# EAGLE design harmoshnik (EAGLE 5.04)
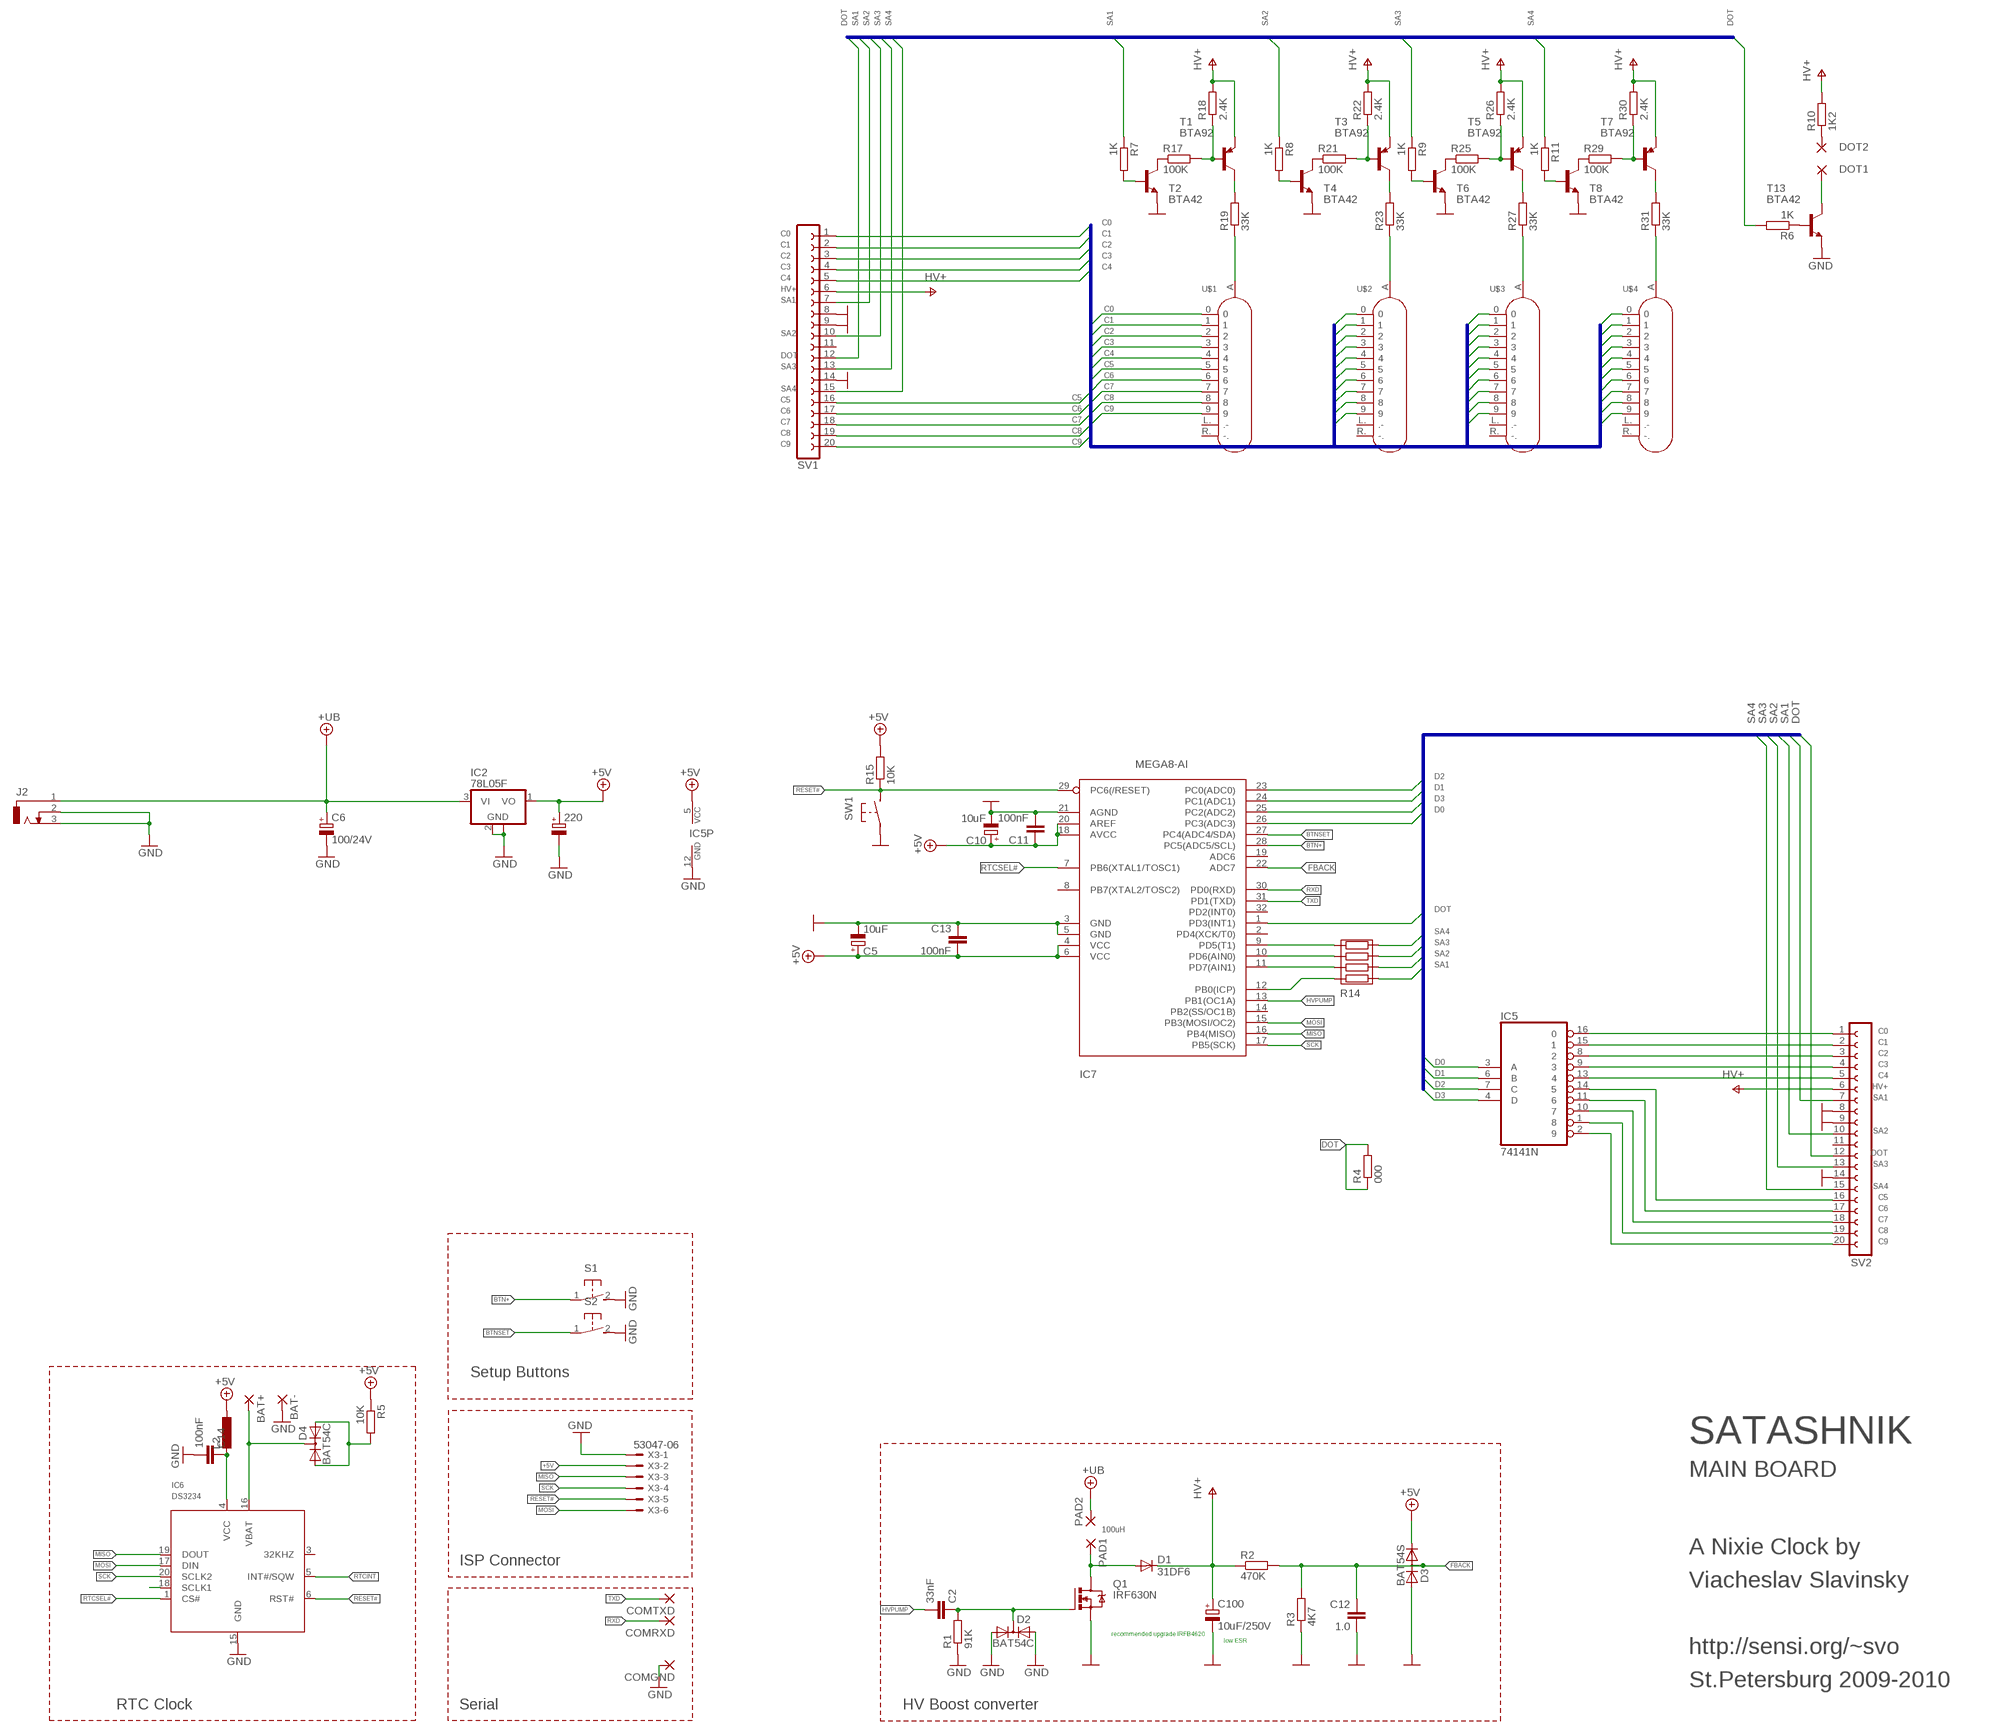
[diagram p0: schematic, sheet 1]

## Parts
220  CPOL-EUD/7343-31R  [D/7343-31R]
BAT+  1,6/0,8  [1,6/0,8]
BAT-  1,6/0,8  [1,6/0,8]
C2  33nF  C-EUC0805S  [C0805S]
C5  10uF  CPOL-EUSMCB  [SMC_B]
C6  100/24V  CPOL-EUE3.5-8  [E3,5-8]
C10  10uF  CPOL-EUSMCB  [SMC_B]
C11  100nF  C-EUC0603K  [C0603K]
C12  1.0  C-EUC0805S  [C0805S]
C13  100nF  C-EUC0603K  [C0603K]
C14  100nF  C-EUC0603K  [C0603K]
C100  10uF/250V  CPOL-EUE5-13  [E5-13]
COMGND  1,6/0,8  [1,6/0,8]
COMRXD  1,6/0,8  [1,6/0,8]
COMTXD  1,6/0,8  [1,6/0,8]
D1  31DF6  RGP30  [DO201-15]
D2  BAT54C  DIODE-2AC|CASOT23  [SOT23]
D3  BAT54S  DIODE_2CACA-SOT23  [SOT23@1]
D4  BAT54C  DIODE-2AC|CASOT23  [SOT23]
DOT1  1,6/0,8  [1,6/0,8]
DOT2  1,6/0,8  [1,6/0,8]
IC2  78L05F  [SOT89]
IC5  74141N  [DIL16]
IC6  DS3234  [SO-20DW]
IC7  MEGA8-AI  [TQFP32-08]
J2  DCJ-SMALL  [DCJ-SMALL]
L2  L-EUL3230M  [L3230M]
PAD1  1,6/0,8  [1,6/0,8]
PAD2  1,6/0,8  [1,6/0,8]
Q1  IRF630N  IRF740  [TO220BV]
R1  91K  R-EU_R0805S  [R0805-SVO]
R2  470K  R-EU_R0805S  [R0805-SVO]
R3  4K7  R-EU_R0805S  [R0805-SVO]
R4  000  R-EU_R0805S  [R0805-SVO]
R5  10K  R-EU_R0805S  [R0805-SVO]
R6  1K  R-EU_R0805S  [R0805-SVO]
R7  1K  R-EU_R0805S  [R0805-SVO]
R8  1K  R-EU_R0805S  [R0805-SVO]
R9  1K  R-EU_R0805S  [R0805-SVO]
R10  1K2  R-EU_R0805S  [R0805-SVO]
R11  1K  R-EU_R0805S  [R0805-SVO]
R14  RES4  [RESSMD-YC16]
R15  10K  R-EU_R0805S  [R0805-SVO]
R17  100K  R-EU_R0805S  [R0805-SVO]
R18  2.4K  R-EU_R0805S  [R0805-SVO]
R19  33K  R-EU_R0805S  [R0805-SVO]
R21  100K  R-EU_R0805S  [R0805-SVO]
R22  2.4K  R-EU_R0805S  [R0805-SVO]
R23  33K  R-EU_R0805S  [R0805-SVO]
R25  100K  R-EU_R0805S  [R0805-SVO]
R26  2.4K  R-EU_R0805S  [R0805-SVO]
R27  33K  R-EU_R0805S  [R0805-SVO]
R29  100K  R-EU_R0805S  [R0805-SVO]
R30  2.4K  R-EU_R0805S  [R0805-SVO]
R31  33K  R-EU_R0805S  [R0805-SVO]
S1  31-XX  [B3F-31XX]
S2  31-XX  [B3F-31XX]
SV1  FE20-1  [FE20]
SV2  FE20-1  [FE20]
SW1  BUTTON-IT_1181  [SW_IT1181]
T1  BTA92  MMBTA92LT1-PNP-SOT23-BEC  [SOT23-BEC]
T2  BTA42  MMBTA42LT1-NPN-SOT23-BEC  [SOT23-BEC]
T3  BTA92  MMBTA92LT1-PNP-SOT23-BEC  [SOT23-BEC]
T4  BTA42  MMBTA42LT1-NPN-SOT23-BEC  [SOT23-BEC]
T5  BTA92  MMBTA92LT1-PNP-SOT23-BEC  [SOT23-BEC]
T6  BTA42  MMBTA42LT1-NPN-SOT23-BEC  [SOT23-BEC]
T7  BTA92  MMBTA92LT1-PNP-SOT23-BEC  [SOT23-BEC]
T8  BTA42  MMBTA42LT1-NPN-SOT23-BEC  [SOT23-BEC]
T13  BTA42  MMBTA42LT1-NPN-SOT23-BEC  [SOT23-BEC]
U$1  IN-14  [IN-14]
U$2  IN-14  [IN-14]
U$3  IN-14  [IN-14]
U$4  IN-14  [IN-14]
X3  53047-06  [53047-06]

## Nets
+5V: 220.+ C5.+ C10.+ C11.1 C13.2 D3.2(C) IC2.1(VO) IC5.5(VCC) IC7.4(VCC) IC7.6(VCC) IC7.18(AVCC) IC7.20(AREF) L2.1 R5.1 R15.2 X3.2
+UB: C6.+ IC2.3(VI) J2.1 PAD2.1(P)
BTN+: IC7.28(PC5(ADC5/SCL)) S1.1(P)
BTNSET: IC7.27(PC4(ADC4/SDA)) S2.1(P)
C0: IC5.16 SV1.1 SV2.1 U$1.0 U$2.0 U$3.0 U$4.0
C1: IC5.15 SV1.2 SV2.2 U$1.1 U$2.1 U$3.1 U$4.1
C2: IC5.8 SV1.3 SV2.3 U$1.2 U$2.2 U$3.2 U$4.2
C3: IC5.9 SV1.4 SV2.4 U$1.3 U$2.3 U$3.3 U$4.3
C4: IC5.13 SV1.5 SV2.5 U$1.4 U$2.4 U$3.4 U$4.4
C5: IC5.14 SV1.16 SV2.16 U$1.5 U$2.5 U$3.5 U$4.5
C6: IC5.11 SV1.17 SV2.17 U$1.6 U$2.6 U$3.6 U$4.6
C7: IC5.10 SV1.18 SV2.18 U$1.7 U$2.7 U$3.7 U$4.7
C8: IC5.1 SV1.19 SV2.19 U$1.8 U$2.8 U$3.8 U$4.8
C9: IC5.2 SV1.20 SV2.20 U$1.9 U$2.9 U$3.9 U$4.9
D0: IC5.3(A) IC7.26(PC3(ADC3))
D1: IC5.6(B) IC7.24(PC1(ADC1))
D2: IC5.7(C) IC7.23(PC0(ADC0))
D3: IC5.4(D) IC7.25(PC2(ADC2))
DOT: IC7.1(PD3(INT1)) R4.1 R4.2 R6.2 SV1.12 SV2.12
FBACK: C12.1 D3.3(AC) IC7.22(ADC7) R2.2 R3.2
GND: 220.- BAT-.1(P) C5.- C6.- C10.- C11.2 C12.2 C13.1 C14.2 C100.- COMGND.1(P) D2.1(A1) D2.2(A2) D3.1(A) IC2.2(GND) IC2.2@1(GND) IC5.12(GND) IC6.15(GND) IC7.3(GND) IC7.5(GND) IC7.21(AGND) J2.2 J2.3 Q1.S R1.1 R3.1 S1.2(S) S2.2(S) SV1.8 SV1.9 SV1.14 SV2.8 SV2.9 SV2.14 SW1.P$1(P1) T2.E T4.E T6.E T8.E T13.E X3.1
HV+: C100.+ D1.C R2.1 R10.2 R18.2 R22.2 R26.2 R30.2 SV1.6 SV2.6 T1.E T3.E T5.E T7.E
HVPUMP: C2.2 IC7.13(PB1(OC1A))
MISO: IC6.19(DOUT) IC7.16(PB4(MISO)) X3.3
MOSI: IC6.17(DIN) IC7.15(PB3(MOSI/OC2)) X3.6
N$1: D4.1(A1) D4.2(A2) R5.2
N$2: IC6.18(SCLK1)
N$3: C2.1 D2.3(C) Q1.G R1.2
N$4: DOT2.1(P) R10.1
N$5: R7.2 T2.B
N$6: R19.2 T1.C
N$7: D1.A PAD1.1(P) Q1.D
N$8: R8.2 T4.B
N$9: BAT+.1(P) D4.3(C) IC6.16(VBAT)
N$10: R19.1 U$1.A
N$11: R21.2 R22.1 T3.B
N$12: R21.1 T4.C
N$13: R23.2 T3.C
N$14: R31.1 U$4.A
N$15: R9.2 T6.B
N$16: R25.2 R26.1 T5.B
N$17: R25.1 T6.C
N$18: R27.2 T5.C
N$19: R23.1 U$2.A
N$20: R11.2 T8.B
N$21: R6.1 T13.B
N$22: R29.2 R30.1 T7.B
N$23: R29.1 T8.C
N$24: R31.2 T7.C
N$25: R27.1 U$3.A
N$26: R17.2 R18.1 T1.B
N$31: IC7.11(PD7(AIN1)) R14.R2$1(2.1)
N$32: IC7.10(PD6(AIN0)) R14.R3$1(3.1)
N$34: IC7.9(PD5(T1)) R14.R4$1(4.1)
N$35: IC7.12(PB0(ICP)) R14.R1$1(1.1)
N$39: R17.1 T2.C
N$51: DOT1.1(P) T13.C
N$53: C14.1 IC6.4(VCC) L2.2
RESET#: IC6.6(RST#) IC7.29(PC6(/RESET)) R15.1 SW1.P$2(P2) X3.5
RTCINT: IC6.5(INT#/SQW)
RTCSEL#: IC6.1(CS#) IC7.7(PB6(XTAL1/TOSC1))
RXD: COMRXD.1(P) IC7.30(PD0(RXD))
SA1: R7.1 R14.R1$2(1.2) SV1.7 SV2.7
SA2: R8.1 R14.R2$2(2.2) SV1.10 SV2.10
SA3: R9.1 R14.R3$2(3.2) SV1.13 SV2.13
SA4: R11.1 R14.R4$2(4.2) SV1.15 SV2.15
SCK: IC6.20(SCLK2) IC7.17(PB5(SCK)) X3.4
TXD: COMTXD.1(P) IC7.31(PD1(TXD))
Unconnected: IC6.3(32KHZ) IC7.2(PD4(XCK/T0)) IC7.8(PB7(XTAL2/TOSC2)) IC7.14(PB2(SS/OC1B)) IC7.19(ADC6) IC7.32(PD2(INT0)) SV1.11 SV2.11 U$1.L.(.-) U$1.R.(-.) U$2.L.(.-) U$2.R.(-.) U$3.L.(.-) U$3.R.(-.) U$4.L.(.-) U$4.R.(-.)

## Buses
D[0..3],SA[1..4],DOT
C[0..9]

## Notes on the sheet
- Setup Buttons
- SATASHNIK
- MAIN BOARD
- 100uH
- A Nixie Clock by
- ISP Connector
- Viacheslav Slavinsky
- recommended upgrade IRFB4620
- low ESR
- http://sensi.org/~svo
- St.Petersburg 2009-2010
- RTC Clock | Serial | HV Boost converter

## Library data of the parts
220 C5 C6 C10 C100 = rcl:CPOL-EU: POLARIZED CAPACITOR, European symbol
BAT+ BAT- COMGND COMRXD COMTXD DOT1 DOT2 PAD1 PAD2 = wirepad:1,6/0,8: THROUGH-HOLE PAD
C2 C11-C14 = rcl:C-EU: CAPACITOR, European symbol
D1 = diode:RGP30: DIODE fast-recovery rectifier
D2 D4 = diode:DIODE-2AC|CA: Dual DIODE Anode-Cathode|Cathode-Anode
D3 = diode:DIODE_2CACA-: 2 Diodes - Cathode-Anode|Cathode-Anode
IC2 = linear:78L*: POSITOIV-VOLTAGE REGULATORS Output up to 100 mA Source: http://focus.ti.com/lit/ds/symlink/ua78l05.pdf
IC5 = 74xx-eu:74*141: BCD to decimal DECODER/DRIVER
IC6 = 0-ds3234:DS3234*: Extremely Accurate SPI Bus RTC with Integrated Crystal and SRAM The DS3234 is a low-cost, extremely accurate SPI? bus real-time clock (RTC) with an integrated temperature-com- pensated crystal oscillator (TCXO) and crystal. The DS3234 incorporates a precision, temperature-compen- sated voltage reference and comparator circuit to monitor VCC. When VCCdrops below the power-fail voltage (VPF), the device asserts the RSToutput and also disables read and write access to the part when VCCdrops below both VPFand VBAT. The RSTpin is monitored as a pushbutton input for generating a µP reset. The device switches to the backup supply input and maintains accurate timekeeping when main power to the device is interrupted. The integra- tion of the crystal resonator enhances the long-term accu- racy of the device as well as reduces the piece-part count in a manufacturing line. The DS3234 is available in com- mercial and industrial temperature ranges, and is offered in an industry-standard 300-mil, 20-pin SO package. The DS3234 also integrates 256 bytes of battery-backed SRAM. In the event of main power loss, the contents of the memory are maintained by the power source con- nected to the VBATpin. The RTC maintains seconds, minutes, hours, day, date, month, and year information. The date at the end of the month is automatically adjust- ed for months with fewer than 31 days, including correc- tions for leap year. The clock operates in either the 24-hour or 12-hour format with AM/PM indicator. Two programmable time-of-day alarms and a programmable square-wave output are provided. Address and data are transferred serially by an SPI bidirectional bus. Accuracy ±2ppm from 0°C to +40°C Accuracy ±3.5ppm from -40°C to +85°C Battery Backup Input for Continuous Timekeeping Operating Temperature Ranges Commercial: 0°C to +70°C Industrial: -40°C to +85°C Low-Power Consumption Real-Time Clock Counts Seconds, Minutes, Hours, Day, Date, Month, and Year with Leap Year Compensation Valid Up to 2099 Two Time-of-Day Alarms Programmable Square-Wave Output 4MHz SPI Bus Supports Modes 1 and 3 Digital Temp Sensor Output: ±3°C Accuracy Register for Aging Trim RSTInput/Output 300-Mil, 20-Pin SO Package Underwriters Laboratories (UL®) Recognized
IC7 = atmel:MEGA8: MICROCONTROLLER 8 Kbytes FLASH, 1 kbytes SRAM, 512 bytes EEPROM, USART, 6-channel 10 bit ADC, 2-channel 8 bit ADC Pin compatible with Atmega48, ATMega88, ATMega168 Source: avr.lbr
J2 = 0-svo:DCJ-SMALL: Smaller DC power jack
L2 = rcl:L-EU: INDUCTOR, European symbol
Q1 = transistor-power:IRF740: N-CHANNEL MOS FET
R1-R11 R15 R17-R19 R21-R23 R25-R27 R29-R31 = rcl:R-EU_: RESISTOR, European symbol
R14 = 0-svo:RES4
S1 S2 = switch-omron:31-XX: OMRON SWITCH
SV1 SV2 = con-lsta:FE20-1: FEMALE HEADER
SW1 = 0-svo:BUTTON-IT_1181
T1 T3 T5 T7 = transistor:*-PNP-: PNP Transistror
T2 T4 T6 T8 T13 = transistor:*-NPN-: NPN Transistror
U$1-U$4 = 0-nixies-russian:IN-14: IN-14 Nixie Tube 170V Strike Voltage 2.5mA Digit Current 0.3mA Dot Current 2 Dots
X3 = con-molex:53?-06: CONNECTOR wire to board 1.25 mm (.049 inch) pitch header

## Board
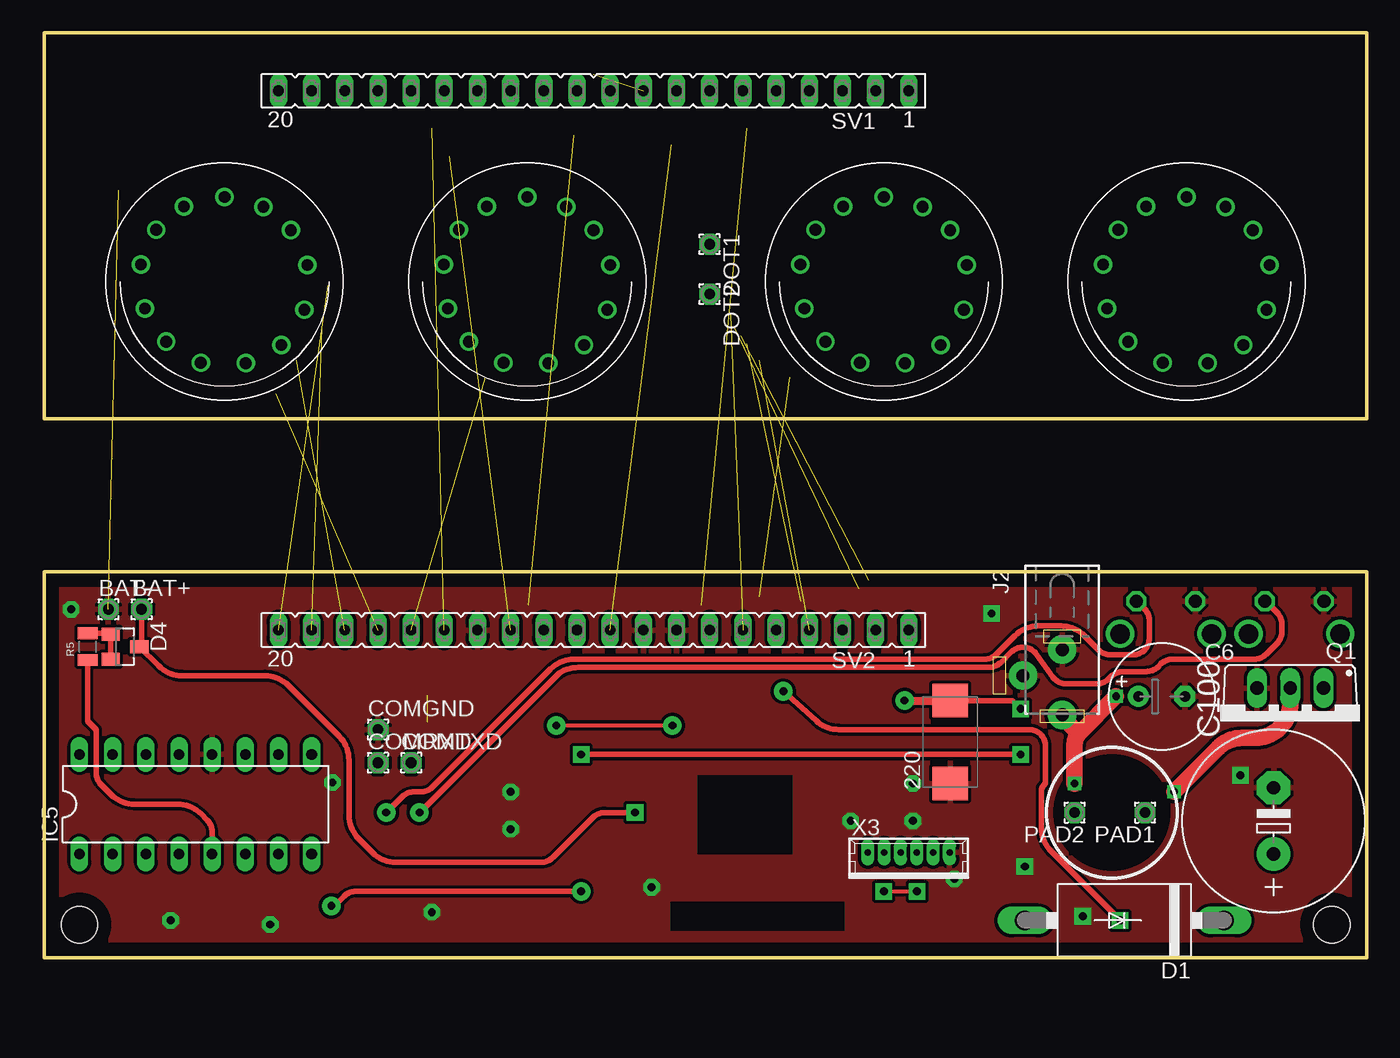
[diagram p1: board, top side]
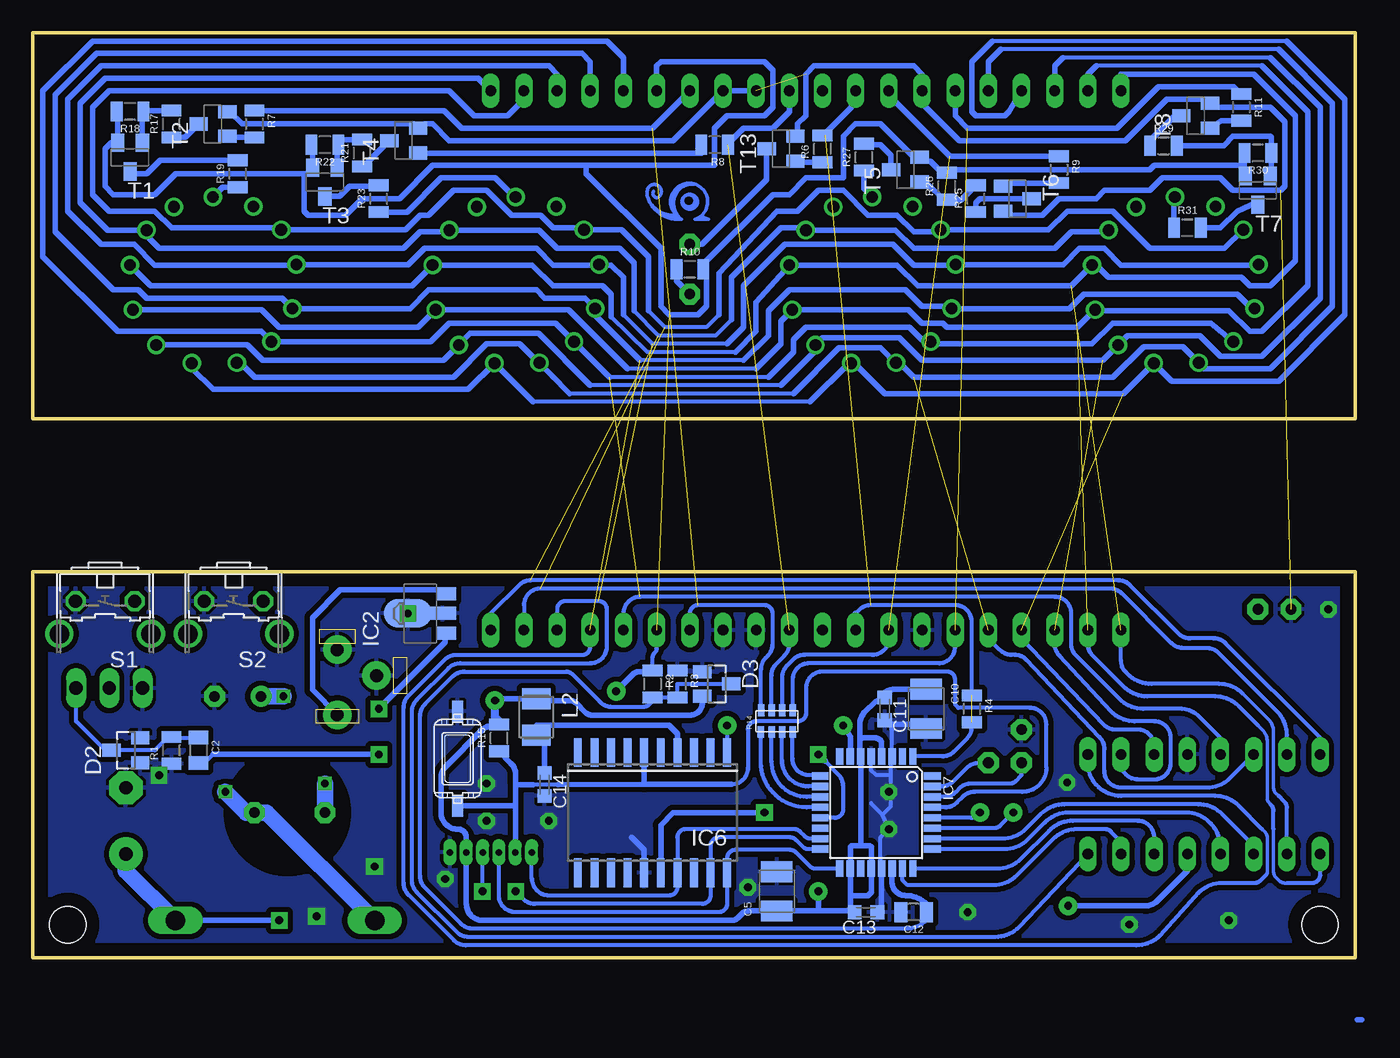
[diagram p2: board, bottom side, seen from below]

Size 101.27 x 70.81 mm. Coordinates in mm from the lower left corner, seen from the top.
Outline: 0,29.54 101.27,29.54 101.27,0 0,0 0,29.54
Outline: 0,70.81 101.27,70.81 101.27,41.27 0,41.27 0,70.81
Copper layers (1*16): Top 0.035mm / dielectric 1.5mm / Bottom 0.035mm
Design rules "default *": minimum track width 10mil, minimum drill 24mil, track to track 10mil, track to pad 10mil, pad to pad 8mil, via to via 8mil, smd to smd 8mil, copper to edge 40mil, drill to drill 8mil, minimum pad ring 10mil, minimum via ring 8mil, stop-mask expansion 4mil, vias tented up to drill 0mil, thermal gap 10mil
Holes 2.8 mm at 98.58,2.54 2.69,2.54
tRestrict: area 50,7.9 to 57.3,14; area 47.9,2.1 to 61.3,4.3; area 77.9,7.3 to 85.6,15
bRestrict: area 77.9,7.3 to 85.6,15

### Footprints (pad centres in the part's own frame; a part is rotated, then mirrored left to right if it is on the bottom)
D/7343-31R = smd 2.55 x 2.7: + 3.175,0; - -3.175,0
1,6/0,8 = drill 0.813 pad 1.6 octagon: 1 0,0
C0805S = smd 1.016 x 1.524: 1 -0.977,0; 2 0.977,0
SMC_B = smd 1.6 x 2.4: + -1.5,0; - 1.5,0
E3,5-8 = drill 0.813 pad 1.6 round: + -1.778,0 | drill 0.813 pad 1.6 octagon: - 1.778,0
C0603K = smd 1.05 x 1.08: 1 -0.875,0; 2 0.875,0
E5-13 = drill 1.016 pad 2.54 round: + -2.54,0 | drill 1.016 pad 2.54 octagon: - 2.54,0
DO201-15 = drill 1.499 long: A 7.62,0; C -7.62,0
SOT23 = smd 1 x 1.4: 1 -0.95,-1.1; 2 0.95,-1.1; 3 0,1.1
SOT23@1 = smd 1 x 1.4: 1 -0.95,-1.1; 2 0.95,-1.1; 3 0,1.1
SOT89 = smd 1 x 1.5: 1 -1.499,-1.981; 3 1.499,-1.981 | smd 1 x 2: 2 0,-1.727 | smd 2.2 x 3.7: 2@1 0,0.94
DIL16 = drill 0.813 long: 1 -8.89,-3.81; 2 -6.35,-3.81; 3 -3.81,-3.81; 4 -1.27,-3.81; 5 1.27,-3.81; 6 3.81,-3.81; 7 6.35,-3.81; 8 8.89,-3.81; 9 8.89,3.81; 10 6.35,3.81; 11 3.81,3.81; 12 1.27,3.81; 13 -1.27,3.81; 14 -3.81,3.81; 15 -6.35,3.81; 16 -8.89,3.81
SO-20DW = smd 0.6 x 2.2: 1 -5.715,-4.6; 2 -4.445,-4.6; 3 -3.175,-4.6; 4 -1.905,-4.6; 5 -0.635,-4.6; 6 0.635,-4.6; 7 1.905,-4.6; 8 3.175,-4.6; 9 4.445,-4.6; 10 5.715,-4.6; 11 5.715,4.6; 12 4.445,4.6; 13 3.175,4.6; 14 1.905,4.6; 15 0.635,4.6; 16 -0.635,4.6; 17 -1.905,4.6; 18 -3.175,4.6; 19 -4.445,4.6; 20 -5.715,4.6
TQFP32-08 = smd 1.27 x 0.559: 1 -4.293,2.8; 2 -4.293,2; 3 -4.293,1.2; 4 -4.293,0.4; 5 -4.293,-0.4; 6 -4.293,-1.2; 7 -4.293,-2; 8 -4.293,-2.8; 17 4.293,-2.8; 18 4.293,-2; 19 4.293,-1.2; 20 4.293,-0.4; 21 4.293,0.4; 22 4.293,1.2; 23 4.293,2; 24 4.293,2.8 | smd 0.559 x 1.27: 9 -2.8,-4.293; 10 -2,-4.293; 11 -1.2,-4.293; 12 -0.4,-4.293; 13 0.4,-4.293; 14 1.2,-4.293; 15 2,-4.293; 16 2.8,-4.293; 25 2.8,4.293; 26 2,4.293; 27 1.2,4.293; 28 0.4,4.293; 29 -0.4,4.293; 30 -1.2,4.293; 31 -2,4.293; 32 -2.8,4.293
DCJ-SMALL = drill 1 pad 2.184 round: 1 0,3; 2 3,0; 3 0,-2
L3230M = smd 1.6 x 2.2: 1 -1.4,0; 2 1.4,0
TO220BV = drill 1.016 long: D 0,-2.54; G -2.54,-2.54; S 2.54,-2.54
R0805-SVO = smd 0.9 x 1.524: 1 -1.027,0; 2 1.027,0
RESSMD-YC16 = smd 0.508 x 0.914: R1$1 -1.23,-0.821; R1$2 -1.2,0.851; R2$1 -0.4,-0.821; R2$2 -0.4,0.851; R3$1 0.4,-0.821; R3$2 0.4,0.851; R4$1 1.2,-0.821; R4$2 1.2,0.851
B3F-31XX = drill 1.016 octagon: 1 -2.261,-1.245; 2 2.261,-1.245 | drill 1.499 pad 2.159 round: 3 -3.505,1.245; 4 3.505,1.245
FE20 = drill 0.813 long: 1 -24.13,0; 2 -21.59,0; 3 -19.05,0; 4 -16.51,0; 5 -13.97,0; 6 -11.43,0; 7 -8.89,0; 8 -6.35,0; 9 -3.81,0; 10 -1.27,0; 11 1.27,0; 12 3.81,0; 13 6.35,0; 14 8.89,0; 15 11.43,0; 16 13.97,0; 17 16.51,0; 18 19.05,0; 19 21.59,0; 20 24.13,0
SW_IT1181 = smd 1.676 x 0.813: P$1 -3.61,0; P$2 3.61,0
SOT23-BEC = smd 1 x 1.4: B -0.95,-1.1; C 0,1.1; E 0.95,-1.1
IN-14 = drill 0.9 round: 0 -5.08,-3.937; 1 5.232,-3.973; 2 6.393,-1.307; 3 6.089,2.063; 4 4.469,4.594; 5 1.822,6.213; 6 -1.621,6.243; 7 -4.348,4.846; 8 -6.12,2.154; 9 -6.35,-1.27; A 0,-6.477; L. 3.104,-5.752; R. -2.978,-5.725
53047-06 = drill 0.5 pad 0.698 long: 1 3.125,0.45; 2 1.875,0.45; 3 0.625,0.45; 4 -0.625,0.45; 5 -1.875,0.45; 6 -3.125,0.45

### Placement (x,y rotation side)
220  69.37,16.52 90 top
BAT+  7.46,26.68 0 top
BAT-  4.92,26.68 0 top
C2  88.58,15.88 270 bottom
C5  44.28,5.08 90 bottom
C6  85.56,20.01 0 top
C10  32.85,19.05 270 bottom
C11  36.03,19.05 270 bottom
C12  33.81,3.5 180 bottom
C13  37.46,3.5 180 bottom
C14  62.06,13.26 270 bottom
C100  94.13,10.48 90 top
COMGND  25.55,17.47 0 top
COMRXD  25.55,14.93 0 top
COMTXD  28.09,14.93 0 top
D1  82.7,2.86 180 top
D2  94.13,15.88 90 bottom
D3  48.89,20.96 270 bottom
D4  6.19,23.82 270 top
DOT1  50.95,54.62 270 top
DOT2  50.95,50.8 270 top
IC2  71.59,26.36 90 bottom
IC5  11.58,11.75 0 top
IC6  53.81,11.12 180 bottom
IC7  36.66,11.12 270 bottom
J2  77.94,21.6 180 top
L2  62.7,18.42 270 bottom
PAD1  84.29,11.12 180 top
PAD2  78.89,11.12 180 top
Q1  95.4,18.1 180 top
R1  90.64,15.88 90 bottom
R2  53.81,20.96 270 bottom
R3  51.91,20.96 270 bottom
R4  29.36,19.05 270 bottom
R5  3.33,23.82 90 top
R6  40.79,61.92 90 bottom
R7  84.29,63.82 270 bottom
R8  49.05,62.24 180 bottom
R9  22.69,60.33 270 bottom
R10  50.95,52.71 0 bottom
R11  8.72,65.09 270 bottom
R14  44.28,18.1 0 bottom
R15  65.56,16.83 90 bottom
R17  90.64,63.82 90 bottom
R18  93.81,64.77 180 bottom
R19  85.56,60.01 90 bottom
R21  76.03,61.6 90 bottom
R22  78.89,62.24 180 bottom
R23  74.77,58.11 90 bottom
R25  29.04,58.11 90 bottom
R26  31.27,59.06 90 bottom
R27  37.62,61.28 90 bottom
R29  14.68,62.16 0 bottom
R30  7.46,61.6 180 bottom
R31  12.85,55.88 0 bottom
S1  95.72,26.04 180 bottom
S2  85.88,26.04 180 bottom
SV1  42.06,66.36 180 top
SV2  42.06,25.09 180 top
SW1  68.73,15.25 270 bottom
T1  93.81,61.28 180 bottom
T2  87.47,63.82 90 bottom
T3  78.89,59.38 180 bottom
T4  72.86,62.55 90 bottom
T5  34.44,60.33 90 bottom
T6  25.87,58.11 270 bottom
T7  7.46,58.74 180 bottom
T8  12.22,64.46 90 bottom
T13  43.97,61.92 90 bottom
U$1  87.47,51.76 180 top
U$2  64.29,51.76 180 top
U$3  36.98,51.76 180 top
U$4  13.8,51.76 180 top
X3  66.19,7.62 0 top

### Tracks (layer width: path | path; a pad name or v marks a point on that pad's centre or on a via)
+5V  (via drill 0.6 pad 1.27, 0.6 pad 1.42)
  Top 0.406: 69.37,20.64 220.+ 74.13,19.69 v74.77,19.05 | v41.11,5.09 23.86,5.09 arc45 22.96,4.71 22.06,3.82 v21.98,3.97 | R5.1 3.33,18.1 3.96,17.47 3.96,14.18 arc45 4.33,13.29 5.12,12.5 arc45 6.92,11.75 10.21,11.75 arc-45 12.01,11.01 12.48,10.54 arc-45 12.85,9.64 IC5.5
  Top 0.61: v65.88,19.69 220.+
  Bottom 0.305: 37.06,8.5 37.14,8.58 | IC7.20 | 37.93,8.58 37.86,8.66 | IC7.6 37.86,16.74
  Bottom 0.406: 37.14,8.58 37.93,8.58 38.57,8.58 | 37.06,8.5 IC7.20 37.06,5.01 37.3,4.77 38.67,4.77 | 37.86,8.66 37.86,15.4 IC7.6 37.93,15.48 37.93,17.89 arc45 37.56,18.79 36.74,19.61 C11.1 36.35,20.01 36.17,20.18 arc45 35.27,20.55 C10.+ | 38.67,8.48 38.67,6.93 38.65,6.91 38.65,6.83 | 38.65,6.83 38.65,6.67 | 38.73,6.91 38.65,6.83 | 38.73,6.91 38.73,7.31 | 38.73,6.91 38.73,6.59 38.67,6.66 IC7.18 38.67,4.77 | 38.89,3.59 38.57,3.59 | 38.57,3.59 38.42,3.59 | 41.11,3.59 38.89,3.59 | 38.67,4.77 38.67,3.81 38.89,3.59 | v41.11,5.09 41.11,3.59 | 65.56,18.1 R15.2 65.63,17.78 65.98,17.78 arc-45 66.88,17.41 69.63,14.66 arc-45 70,13.77 70,11.12 arc-90 68.73,9.85 arc90 68.07,9.18 X3.2 68.07,4.13 arc-90 66.8,2.86 47.72,2.86 arc-45 47.27,3.05 46.92,3.4 arc45 46.47,3.59 C5.+ 41.11,3.59 | IC7.4 36.27,16.43 arc-78 36.76,16.83 37.78,16.83 37.86,16.74 | D3.2 49.99,19.53 arc90 50.94,18.58 58.47,18.58 arc45 58.92,18.76 59.66,19.5 arc-45 60.11,19.69 62.57,19.69 L2.1 65.75,19.82 v65.88,19.69 | IC5.5 12.85,6.67 15.18,4.35 arc45 16.08,3.97 v21.98,3.97 | IC2.1 69.69,24.78 69.69,24.14 v74.77,19.05 | C13.2 38.48,3.5 38.57,3.59
  Bottom 0.61: v65.88,19.69 65.88,18.42 65.56,18.1
+UB  (via drill 0.6)
  Top 1.27: 79.21,17.15 v82.07,20.01 | J2.1 77.94,18.42 79.21,17.15 | v78.89,13.34 78.89,16.38 arc-45 79.21,17.15
  Bottom 0.406: J2.1 79.85,20.5 79.85,26.04 77.71,28.17 70.38,28.17 arc45 IC2.3
  Bottom 1.27: PAD2.1 v78.89,13.34 | v82.07,20.01 C6.+
BTN+  (via drill 0.6 pad 1.42)
  Top 0.406: S1.1 93.52,27.28 94.4,26.41 arc-45 94.77,25.51 94.77,24.98 arc-45 94.4,24.08 93.55,23.24 arc-45 92.65,22.87 86.4,22.87 arc45 85.51,22.49 85.3,22.28 arc-45 84.4,21.91 82.59,21.91 arc45 81.7,21.54 81.49,21.33 arc-45 80.59,20.96 78.27,20.96 arc-54 77.24,21.48 75.96,23.25 arc99 74.03,23.4 73.23,22.6 arc-45 72.33,22.23 40.89,22.23 arc45 39.1,21.49 v28.73,11.12
  Bottom 0.305: IC7.28 29.39,10.72 arc-45 28.94,10.9 v28.73,11.12
BTNSET  (via drill 0.6 pad 1.42)
  Top 0.406: S2.1 83.68,27.28 84.24,26.73 arc-45 84.61,25.83 84.61,24.45 arc-90 83.34,23.18 81.64,23.18 arc-45 80.74,23.55 79.64,24.66 arc45 77.84,25.41 76.13,25.41 arc45 74.34,24.66 72.91,23.24 arc-45 72.02,22.87 57.62,22.87 40.57,22.87 arc45 38.78,22.12 29.73,13.08 arc-45 28.84,12.7 28.3,12.7 arc45 27.4,12.33 v26.19,11.12
  Bottom 0.305: IC7.27 27.65,9.92 arc-45 27.2,10.1 v26.19,11.12
C0  (1 unrouted)
  Bottom 0.305: SV2.1 66.19,26.36 64.02,28.53 arc45 63.13,28.9 18.14,28.9 arc45 17.24,28.53 13.54,24.82 arc-45 12.64,24.45 10.84,24.45 arc45 9.94,24.08 2.69,16.83 IC5.16 | 47.78,48.82 48.97,47.63 53.33,47.63 55.24,49.54
  Bottom 0.406: U$4.0 19.01,55.57 21.74,55.57 23.01,54.3 33.81,54.3 35.2,55.69 U$3.0 42.25,55.88 43.97,55.88 47.78,52.08 47.78,48.82 | SV1.1 67.14,67.32 95.72,67.32 97.63,65.41 97.63,57.79 95.53,55.69 U$1.0 92.55,55.25 91.59,54.3 72.86,54.3 71.59,55.57 69.49,55.57 U$2.0 62.51,55.69 61.11,54.3 56.35,54.3 55.24,53.19 55.24,49.54
C1  (1 unrouted)
  Bottom 0.305: IC5.15 5.23,17.05 arc-45 5.98,18.85 10.47,23.34 arc-45 11.36,23.71 13.17,23.71 arc45 14.07,24.08 17.88,27.89 arc-45 18.78,28.26 62.38,28.26 arc-90 63.65,26.99 SV2.2 | 48.73,49.22 49.68,48.26 52.86,48.26 54.13,49.54
  Bottom 0.406: U$2.1 59.22,55.57 | 8.74,55.57 U$4.1 10.01,54.3 15.71,54.3 18.57,57.16 22.06,57.16 23.48,55.73 U$3.1 31.91,55.57 33.81,55.57 35.08,56.84 37.3,56.84 39.21,58.74 41.11,58.74 42.7,57.16 44.28,57.16 48.73,52.39 48.73,49.22 | U$2.1 | U$2.1 59.21,55.88 61.43,55.88 62.38,56.84 64.61,56.84 66.51,58.74 69.05,58.74 70.96,56.84 71.59,56.84 72.7,55.73 U$1.1 82.39,55.88 90.64,55.88 91.91,57.16 95.4,57.16 96.67,58.43 96.67,65.09 95.4,66.36 69.37,66.36 67.46,64.46 64.92,64.46 63.65,65.73 SV1.2 | U$2.1 56.2,55.73 54.13,53.66 54.13,49.54
C2  (1 unrouted)
  Bottom 0.305: SV2.3 61.11,26.67 arc90 60.48,27.31 57.94,27.31 arc90 57.3,26.67 57.3,23.82 arc90 58.57,22.55 68.52,22.55 arc-45 69.42,22.18 71.85,19.74 arc-45 72.22,18.85 72.22,5.93 arc-45 71.85,5.03 68.79,1.96 arc-45 67.89,1.59 27.56,1.59 arc-45 25.76,2.34 IC5.8 | 48.1,46.99 53.81,46.99 56.03,49.22
  Bottom 0.406: U$4.2 7.45,53.03 17.93,53.03 19.2,54.3 21.11,54.3 22.34,53.06 U$3.2 30.63,53.03 33.81,53.03 35.39,54.62 43.65,54.62 46.82,51.44 46.82,48.26 48.1,46.99 | SV1.3 61.11,67.63 61.75,68.27 96.04,68.27 98.58,65.73 98.58,57.16 96.04,54.62 93.5,54.62 91.91,53.03 81.11,53.03 U$1.2 72.51,53.06 71.27,54.3 62.7,54.3 61.43,53.03 57.93,53.03 U$2.2 57.86,53.03 56.99,53.03 56.03,52.08 56.03,49.22
C3  (1 unrouted)
  Bottom 0.254: 6.82,6.35 arc-45 6.74,6.55 6.74,9.19 arc-45 6.93,9.64 7.14,9.85
  Bottom 0.305: 6.82,6.35 7.27,5.91 arc45 7.72,5.72 10.21,5.72 arc-45 12.01,4.98 14.97,1.7 arc45 16.76,0.96 68.11,0.96 arc45 69,1.33 72.49,4.81 arc45 72.86,5.71 72.86,19.16 arc45 72.49,20.06 69.74,22.81 arc45 68.84,23.18 59.21,23.18 arc-90 58.57,23.82 SV2.4 | 7.14,9.85 8.93,11.64 arc-45 10.73,12.39 17.93,12.39 arc90 20.47,14.93 IC5.9 | 46.82,45.73 54.76,45.73
  Bottom 0.406: U$4.3 7.88,49.54 7.77,49.54 9.04,50.8 20.79,50.8 21.9,49.69 U$3.3 31.05,49.85 33.17,49.85 34.44,51.12 43.33,51.12 44.92,49.54 44.92,47.63 46.82,45.73 | SV1.4 58.57,68.59 59.21,69.22 96.36,69.22 99.53,66.04 99.53,55.57 95.08,51.12 93.18,51.12 92.55,50.49 82.17,50.49 U$1.3 72.38,49.69 70.96,51.12 62.7,51.12 62.06,50.49 58.99,50.49 U$2.3 58.25,49.64 58.25,49.22 54.76,45.73
C4  (1 unrouted)
  Bottom 0.305: SV2.5 56.03,26.36 arc90 54.76,27.63 23.01,27.63 arc90 21.74,26.36 21.74,24.03 arc-45 21.37,23.13 18.04,19.8 arc-45 16.25,19.05 13.27,19.05 arc45 11.79,18.31 10.31,16.83 IC5.13 | 44.92,44.45 57.11,44.45
  Bottom 0.406: 32.54,46.99 32.68,46.99 U$3.4 | U$3.4 32.39,47.16 32.22,46.99 20.15,46.99 18.57,48.58 11.07,48.58 U$4.4 | U$3.4 32.66,47.31 33.17,47.31 34.13,48.26 42.06,48.26 43.02,47.31 43.02,46.36 44.92,44.45 | SV1.5 56.03,68.9 57.3,70.17 96.67,70.17 100.48,66.36 100.48,53.66 94.77,47.95 83.78,47.95 U$1.4 70.79,47.16 69.37,48.58 61.24,48.58 U$2.4 57.11,44.45
C5  (1 unrouted)
  Bottom 0.305: SV2.16 28.09,24.45 27.19,23.55 arc-45 26.3,23.18 26.08,23.18 arc45 25.18,22.81 19.57,16.89 arc45 19.2,15.99 19.2,14.29 arc-90 17.93,13.02 11.36,13.02 arc-45 9.57,13.77 IC5.14 | 5.87,69.54 27.14,69.54 | 43.02,43.19 60.16,43.19
  Bottom 0.406: U$1.5 85.38,45.54 84.29,44.45 69.05,44.45 66.51,46.99 63.97,46.99 62.38,45.41 | 62.38,45.41 62.6,45.41 U$2.5 62.47,45.49 62.38,45.41 | 61.59,44.61 61.43,44.45 | 61.59,44.61 62.38,45.41 | SV1.16 28.09,68.59 27.14,69.54 | 5.87,69.54 1.74,65.41 1.74,49.85 6.5,45.09 11.58,45.09 11.85,45.41 U$4.5 13.2,46.76 16.19,46.76 18.57,44.45 33.81,44.45 34.9,45.54 U$3.5 35.3,45.41 35.08,45.41 36.35,46.68 39.52,46.68 43.02,43.19 | 60.16,43.19 61.59,44.61
C6  (1 unrouted)
  Bottom 0.305: IC5.11 15.39,16.2 arc-90 16.66,17.47 18.36,17.47 arc45 19.26,17.84 25.55,24.45 SV2.17 | 5.23,70.17 27.78,70.17 | 41.74,42.55 62.94,42.55
  Bottom 0.406: U$1.6 89.09,45.12 87.47,43.5 67.92,43.5 U$2.6 62.94,42.55 | 27.78,70.17 29.36,68.59 29.36,64.77 29.04,64.46 26.82,64.46 26.51,64.77 SV1.17 | 5.23,70.17 0.79,65.73 0.79,49.22 5.87,44.14 14.05,44.14 U$4.6 17.76,43.19 36.03,43.19 38.36,45.51 U$3.6 38.78,45.51 41.74,42.55
C7  (1 unrouted)
  Bottom 0.305: SV2.18 23.01,24.03 arc-45 22.64,23.13 18.68,18.85 arc-45 16.88,18.1 15.39,18.1 arc90 14.12,16.83 14.12,14.93 arc90 15.39,13.66 16.66,13.66 arc90 17.93,14.93 IC5.10 | 6.5,68.9 22.38,68.9 | 43.97,43.82 58.57,43.82
  Bottom 0.406: U$1.7 84.84,46.91 83.66,45.73 69.82,45.73 U$2.7 68.64,46.93 67.78,47.79 62.54,47.79 58.57,43.82 | SV1.18 23.01,68.27 22.38,68.9 | 6.5,68.9 2.69,65.09 2.69,50.49 7.14,46.04 10.31,46.04 11.9,47.63 17.43,47.63 U$4.7 19.34,45.73 33.17,45.73 34.92,47.47 40.79,47.47 41.33,46.93 U$3.7 41.33,46.46 43.97,43.82
C8  (1 unrouted)
  Bottom 0.254: 5.23,5.72 5.37,5.72 arc45 5.82,5.91 6.08,6.17 arc45 6.26,6.62 6.26,9.85 | 6.5,11.75 6.55,11.8 arc45 6.74,12.25 6.74,16.54 arc-45 7.11,17.44 7.46,17.78
  Bottom 0.305: 5.23,5.72 3.33,5.72 arc-90 2.69,6.35 IC5.1 | SV2.19 20.47,24.03 arc-45 20.1,23.13 17.72,20.75 arc-45 15.93,20.01 10.73,20.01 arc45 8.93,19.26 7.46,17.78 | 6.26,9.85 6.26,11.25 arc-45 6.45,11.7 6.5,11.75 | 7.14,68.27 19.84,68.27 | 45.87,45.09 55.71,45.09
  Bottom 0.406: U$1.8 83.72,49.6 82.39,48.26 71.75,48.26 U$2.8 60.23,49.6 55.71,45.09 | SV1.19 20.47,67.63 19.84,68.27 | 7.14,68.27 3.65,64.77 3.65,51.44 7.14,47.95 8.09,47.95 9.68,49.54 19.86,49.54 U$4.8 21.26,48.26 31.27,48.26 31.59,48.58 33.17,48.58 34.19,49.6 U$3.8 43.97,48.74 43.97,46.99 45.87,45.09
C9  (1 unrouted)
  Bottom 0.254: 5.87,12.39 6.08,12.6 arc45 6.26,13.05 6.26,17.34 arc-45 6.64,18.24 8.62,20.22
  Bottom 0.305: SV2.20 17.93,22.76 arc-45 17.56,21.86 17.41,21.7 arc-45 15.61,20.96 10.41,20.96 arc45 8.62,20.22 | IC5.2 5.23,11.49 arc-45 5.42,11.94 5.87,12.39 | 47.46,46.36 54.21,46.36 56.98,49.06
  Bottom 0.406: U$1.9 92.23,51.44 72.22,51.44 U$2.9 63.02,53.03 61.43,51.44 57.62,51.44 56.99,50.8 56.98,49.06 | SV1.20 17.93,67.63 7.77,67.63 4.6,64.46 4.6,53.34 6.5,51.44 8.09,51.44 8.72,52.08 18.88,52.08 19.84,53.03 U$4.9 21.74,51.44 33.49,51.44 35.08,53.03 U$3.9 45.87,50.17 45.87,47.95 47.46,46.36
D0
  Bottom 0.305: IC5.3 7.77,8.58 10.2,11.01 arc-45 12,11.75 22.28,11.75 arc-45 24.07,11.01 25.22,9.86 arc45 27.02,9.12 IC7.26
D1
  Bottom 0.305: IC7.24 27.4,6.82 arc-45 25.61,7.57 23.44,9.74 arc45 21.64,10.48 16.66,10.48 arc90 15.39,9.21 IC5.6
D2
  Bottom 0.305: IC5.7 17.93,8.9 18.7,9.66 arc-45 19.15,9.85 21.33,9.85 arc-45 23.12,9.1 25.92,6.31 arc45 27.72,5.56 34.28,5.56 34.67,5.94 IC7.23
D3
  Bottom 0.305: IC5.4 10.31,8.48 arc-45 11.06,10.27 11.16,10.37 arc-45 12.95,11.12 21.96,11.12 arc-45 23.76,10.37 25.07,9.06 arc45 26.86,8.32 IC7.25
DOT  (2 unrouted)
  Bottom 0.305: R4.1 29.36,25.72 arc-90 30.63,26.99 37.09,26.99 arc-45 37.99,26.62 38.25,26.36 | IC7.1 31.63,15.41 arc-45 30.73,15.78 29.73,16.78 arc-45 29.36,17.68 R4.2
  Bottom 0.406: 38.25,26.36 SV2.12 | R6.2 40.56,62.94 40.56,63.1 38.57,65.09 38.57,66.04 SV1.12
FBACK
  Bottom 0.305: R2.2 R3.2 51.91,20.96 | 51.91,20.96 D3.3 | C12.1 32.85,3.79 32.85,2.86 arc45 34.39,2.23 67.57,2.23 arc45 68.47,2.6 71.22,5.35 arc45 71.59,6.25 71.59,18.53 arc45 71.22,19.43 69.1,21.54 arc45 68.21,21.91 60.42,21.91 arc45 59.97,21.73 57.83,19.59 arc-45 56.94,19.21 54.53,19.21 arc-90 R2.2 | 51.91,20.96 51.27,20.96 | R2.2 53.88,19.69
  Bottom 0.406: C12.1 32.83,4.11 arc-45 34.42,4.77 arc90 35.46,5.81 IC7.22
GND  (via drill 0.6 pad 1.27)  (2 unrouted)
  Bottom 0.305: 35.55,13.98 35.55,11.59 36.19,10.96 | 35.55,13.98 35.55,15.32 IC7.3 35.47,15.42 35.47,17.48 35.46,17.48 | 36.19,10.96 v35.71,9.85 36.35,9.21 36.35,6.91 IC7.21 | 36.19,10.96 37.06,11.84 | IC7.5 37.06,14.37 36.67,13.98 35.55,13.98
  Bottom 0.406: 35.47,17.87 32.85,17.86 | 32.85,17.86 arc44 32.85,17.86 | 32.85,17.86 C10.- | 35.47,17.87 36.04,17.87 C11.2 | 35.46,17.48 35.47,17.87 | 36.27,3.5 IC7.21 | IC6.15 54.45,8.26 55.4,9.21 | 35.47,15.42 IC7.3 | 42.55,62.7 T13.E 42.7,63.04 42.7,63.82 42.06,64.46 42.06,67.63 41.43,68.27 33.81,68.27 33.17,67.63 SV1.14 33.17,65.41 30.31,62.55 17.62,62.55 14.44,65.73 11.12,65.73 T8.E 10.8,65.09 6.5,65.09 5.39,63.98 5.39,59.06 5.71,58.74 9.36,58.74 10.31,59.69 14.76,59.69 15.71,58.74 19.2,58.74 19.84,58.11 22.69,58.11 23.97,56.84 26.82,56.84 27.14,57.16 T6.E | SV1.9 SV1.8 52.22,62.55 69.37,62.55 70.64,63.82 71.27,63.82 71.76,63.34 T4.E 72.08,63.82 85.24,63.82 86.19,64.77 T2.E
  other vias: 61.75,10.48 91.59,13.98 17.3,2.54 29.68,3.5 22.06,13.42 2.06,26.68 35.71,12.7 46.51,5.4 69.69,6.04 72.54,26.36 9.68,2.86 79.53,3.18 75.08,6.99 66.51,10.48 66.51,13.34
  pour Top: -1.44,30.48 102.07,30.48 102.07,-0.63 -1.12,-0.95
  pour Bottom (isolate 0.406): -1.75,30.17 102.07,30.17 102.07,-0.95 -1.75,-0.95
GRUU1
  Bottom 0.254: 53.73,58.66 arc-128 53.41,58.19 arc-232 54.21,58.74 arc-38 54.21,58.27 arc-71 51.91,56.52 51.59,56.52 51.98,56.84 arc298 50.56,56.52 49.52,56.52 50.08,56.76
GRUU2
  Bottom 0.254: 51.83,56.68 52.01,57.01 arc23 52.17,57.5 52.19,57.67 arc25 52.13,58.21 52.06,58.43 51.89,58.67 arc34 51.3,59.12 51.25,59.14 arc21 50.8,59.22 50.63,59.22
GRUU3
  Bottom 0.254: 53.89,57.63 53.45,57.24 arc-23 53.01,56.99 52.74,56.9 arc-18 52.33,56.84 52.06,56.84 51.98,56.76 52.3,56.68
HV+  (via drill 0.6 pad 1.27, 0.6 pad 1.42)  (1 unrouted)
  Top 0.406: v56.59,20.4 59.11,18.14 arc43 60.83,17.47 75.4,17.47 arc-90 76.67,16.2 76.67,13.56 arc-45 76.51,13.18 arc45 76.35,12.8 76.35,9.95 arc45 77.1,8.15 v82.39,2.86
  Bottom 0.305: SV2.6 53.49,23.69 arc45 53.62,23.37 arc-45 53.81,22.92 R2.1 53.88,21.91
  Bottom 0.406: v82.39,2.86 D1.C | T5.E 33.27,61.36 | T5.E 33.81,61.28 36.35,63.82 38.25,63.82 39.21,62.87 39.21,59.69 42.06,59.69 43.33,58.43 44.6,58.43 49.93,53.1 R10.2 49.68,52.47 49.68,49.85 50.32,49.22 52.54,49.22 53.17,49.85 53.17,54.3 58.89,60.01 58.89,60.65 | SV1.6 53.49,68.27 53.17,68.59 45.24,68.59 44.6,67.95 44.6,65.09 45.24,64.46 48.1,64.46 49.05,63.51 49.05,60.65 58.89,60.65 | R22.2 79.84,62.48 T3.E 80.24,60.09 | 80.24,60.09 80.48,59.84 80.48,57.16 80.16,56.84 77.3,56.84 76.03,58.11 73.18,58.11 70.64,60.65 58.89,60.65 | 80.24,60.09 80.31,60.01 90.32,60.01 91.91,58.43 95.08,58.43 95.72,59.06 95.72,61.92 95.25,62.38 T1.E 94.77,64.7 R18.2 | T5.E 33.03,60.97 32.54,60.97 31.66,60.09 R26.2 31.02,60.33 15.71,60.33 15.39,60.65 8.48,60.65 | T7.E 8.48,59.92 8.48,60.65 | 8.48,60.65 R30.2 | 53.88,21.91 54.82,21.91 arc-45 55.27,21.73 v56.59,20.4
  Bottom 1.27: C100.+ 94.13,6.67 D1.C
HVPUMP  (via drill 0.6 pad 1.27)
  Top 0.406: v41.11,15.56 v74.77,15.56
  Bottom 0.305: IC7.13 39.84,10.72 arc-90 39.21,11.35 39.21,13.13 arc-45 39.58,14.03 40.58,15.03 | 87.47,15.56 88.1,14.93 88.55,14.93 C2.2
  Bottom 0.406: 40.58,15.03 v41.11,15.56 41.27,15.72 | v74.77,15.56 87.47,15.56
MISO  (via drill 0.6 pad 1.27)
  Top 0.305: v64.29,5.09 v66.83,5.09
  Bottom 0.305: IC7.16 41.86,8.32 arc45 42.31,8.5 42.83,9.03 arc-45 43.28,9.21 48.73,9.21 arc-90 49.36,8.58 IC6.19 49.36,4.77 arc90 50,4.13 62.81,4.13 arc45 63.71,4.5 v64.29,5.09 | v66.83,5.09 66.83,8.07 X3.3
MOSI
  Bottom 0.305: IC7.15 41.7,9.12 arc45 42.15,9.3 42.51,9.66 arc-45 42.96,9.85 51.27,9.85 arc-90 51.91,9.21 IC6.17 51.91,5.4 arc90 52.54,4.77 61.75,4.77 arc90 63.02,6.04 63.07,6.04 X3.6
N$1
  Top 0.406: R5.2 5.01,24.84 D4.1 D4.2
N$3
  Bottom 0.305: C2.1 90.59,16.86 R1.2 90.88,16.91 91.91,15.88 D2.3 95.72,15.88 97.94,18.1 Q1.G
N$4
  Bottom 0.406: R10.1 51.98,51.83 DOT2.1
N$5
  Bottom 0.406: R7.2 86.29,62.8 T2.B
N$6
  Bottom 0.406: R19.2 91.52,61.04 92.55,60.01 93.64,60.01 T1.C
N$7  (via drill 0.6)
  Top 1.27: v86.51,12.7 89.9,16.09 arc-45 91.69,16.83 92.76,16.83 arc45 94.56,17.58 94.66,17.68 arc45 95.4,19.47 Q1.D
  Bottom 1.27: D1.A 83.34,11.12 PAD1.1 84.92,11.12 v86.51,12.7
N$8
  Bottom 0.406: 71.68,61.53 T4.B 50.07,61.6 R8.2
N$9  (via drill 0.6 pad 1.27)
  Top 0.406: BAT+.1 7.46,23.99 D4.3 8.76,22.34 arc45 10.56,21.6 16.88,21.6 arc-45 18.68,20.85 22.59,16.94 arc-45 23.33,15.15 23.33,10.9 arc45 24.07,9.1 25.13,8.05 arc45 26.92,7.31 38.04,7.31 arc45 38.94,7.68 42.01,10.75 arc-45 42.91,11.12 v45.24,11.12
  Bottom 0.406: IC6.16 53.17,10.17 52.22,11.12 v45.24,11.12
N$10
  Bottom 0.406: R19.1 86.71,58.99 U$1.A
N$11
  Bottom 0.406: T3.B 77.94,62.48 R22.1 77.47,62.63 R21.2
N$12
  Bottom 0.406: R21.1 75.94,60.57 T4.C
N$13
  Bottom 0.406: T3.C 77.77,58.28 76.99,59.06 74.84,59.06 R23.2
N$14
  Bottom 0.406: R31.1 13.88,58.16 U$4.A
N$15
  Bottom 0.406: R9.2 27.04,59.3 T6.B
N$16
  Bottom 0.406: T5.B 33.27,59.3 32.78,59.3 31.51,58.03 R26.1 30.15,58.03 R25.2
N$17
  Bottom 0.406: T6.C 28.73,58.11 29.04,57.79 R25.1
N$18
  Bottom 0.406: T5.C 35.54,61.43 36.35,62.24 37.54,62.24 R27.2
N$19
  Bottom 0.406: U$2.A 64.41,58.23 65.88,59.69 70,59.69 72.62,57.08 R23.1
N$20
  Bottom 0.406: R11.2 10.24,64.07 T8.B
N$21
  Bottom 0.406: R6.1 43.11,60.89 T13.B
N$22
  Bottom 0.406: T7.B 6.43,59.92 R30.1 6.43,62.8 6.5,62.87 9.36,62.87 10.07,62.16 R29.2
N$23
  Bottom 0.406: T8.C 13.8,64.46 15.71,62.55 R29.1
N$24
  Bottom 0.406: R31.2 10.31,55.88 9.04,57.16 7.6,57.79 T7.C
N$25
  Bottom 0.406: R27.1 37.62,58.87 U$3.A
N$26
  Bottom 0.406: T1.B 92.86,64.7 R18.1 92.71,64.85 R17.2
N$30
  Bottom 0.406: -0.16,-4.76 -0.48,-4.76
N$31
  Bottom 0.305: IC7.11 41.99,12.32 arc90 44.68,15.02 R14.R2$1
N$32
  Bottom 0.305: IC7.10 41.88,13.12 arc90 43.88,15.12 R14.R3$1
N$34
  Bottom 0.305: R14.R4$1 43.09,15.25 arc-90 41.81,13.98 41.02,13.98 IC7.9
N$35
  Bottom 0.305: IC7.12 42.02,11.52 arc90 45.52,15.02 R14.R1$1
N$39
  Bottom 0.406: R17.1 89.59,62.8 T2.C
N$51
  Bottom 0.406: T13.C 45.07,59.55 50,54.62 DOT1.1
N$53
  Bottom 0.305: 62.06,16.51 62.7,16.51 L2.2
  Bottom 0.406: IC6.4 51.91,17.15 52.54,17.78 62.7,17.78 L2.2 | 62.06,16.51 C14.1
RESET#
  Bottom 0.305: IC7.29 31.39,11.52 arc-45 30.5,11.89 30.05,12.33 arc45 29.15,12.7 25.5,12.7 arc-90 23.65,14.56 23.65,17.86 arc-90 24.92,19.13 30.39,19.13 30.63,19.37 30.63,21.28 arc-90 31.27,21.91 40.78,21.91 arc-90 42.05,20.64 42.05,18.74 arc90 42.69,18.1 45.87,18.1 arc-90 46.51,17.47 46.51,14.54 arc90 47.78,13.27 | 64.29,8.08 X3.5 | 61.03,13.26 62.94,13.26
  Bottom 0.406: 47.78,13.27 54.45,13.27 | 54.45,13.27 IC6.6 | 54.45,13.27 61.03,13.26 | 64.29,13.34 64.29,11.75 | 64.29,11.75 64.29,8.08 | 64.29,13.34 64.29,14.01 arc-45 64.66,14.91 R15.1 | 62.94,13.26 64.1,13.26 arc45 64.29,13.34 | SW1.P$2 64.41,11.64 64.29,11.75
RTCSEL#  (via drill 0.6 pad 1.42)
  Top 0.305: v39.21,17.78 v48.1,17.78
  Bottom 0.305: v48.1,17.78 IC6.1
  Bottom 0.406: IC7.7 38.67,16.93 v39.21,17.78
RXD
  Bottom 0.305: COMRXD.1 25.55,13.98 26,13.53 arc45 26.45,13.34 29.42,13.34 arc-45 30.31,12.97 30.59,12.69 arc45 31.49,12.32 IC7.30
SA1  (1 unrouted)
  Bottom 0.305: R14.R1$2 45.49,22.09 arc45 45.11,22.99 44.97,23.13 arc-45 44.6,24.03 44.6,26.36 arc-90 45.24,26.99 50.32,26.99 arc-90 50.95,26.36 SV2.7
  Bottom 0.406: R7.1 69.76,64.85 68.41,63.51 53.81,63.51 SV1.7
SA2  (1 unrouted)
  Bottom 0.305: R14.R2$2 44.68,21.62 arc45 44.31,22.52 43.7,23.13 arc-45 43.33,24.03 SV2.10
  Bottom 0.406: R8.1 48.02,62.31 46.82,63.51 44.6,63.51 43.33,64.77 SV1.10
SA3  (1 unrouted)
  Bottom 0.305: R14.R3$2 43.88,21.47 arc45 43.51,22.37 43.07,22.81 arc45 42.17,23.18 36.98,23.18 arc-90 35.71,24.45 SV2.13
  Bottom 0.406: R9.1 31.02,61.36 35.39,65.73 SV1.13
SA4  (1 unrouted)
  Bottom 0.305: R14.R4$2 43.09,21.28 arc90 41.81,22.55 31.9,22.55 arc-90 30.63,23.82 SV2.15
  Bottom 0.406: SV1.15 30.63,64.46 29.68,63.51 18.25,63.51 15.07,66.68 9.29,66.68 R11.1 9.12,66.12
SCK
  Bottom 0.305: IC7.17 41.32,6.82 arc45 41.77,7.01 42.83,8.07 arc-45 43.28,8.26 47.46,8.26 arc-90 48.1,7.62 IC6.20 48.1,4.13 arc90 48.73,3.5 64.3,3.5 arc90 65.57,4.77 X3.4
TXD
  Bottom 0.305: IC7.31 31.7,13.12 arc-45 30.8,13.49 29.73,14.56 arc45 28.84,14.93 COMTXD.1
(copper drawn outside any net)
  shapes: Bottom circle x2

### Text on the board
SMD16: 2010 | HARMOSHNIK